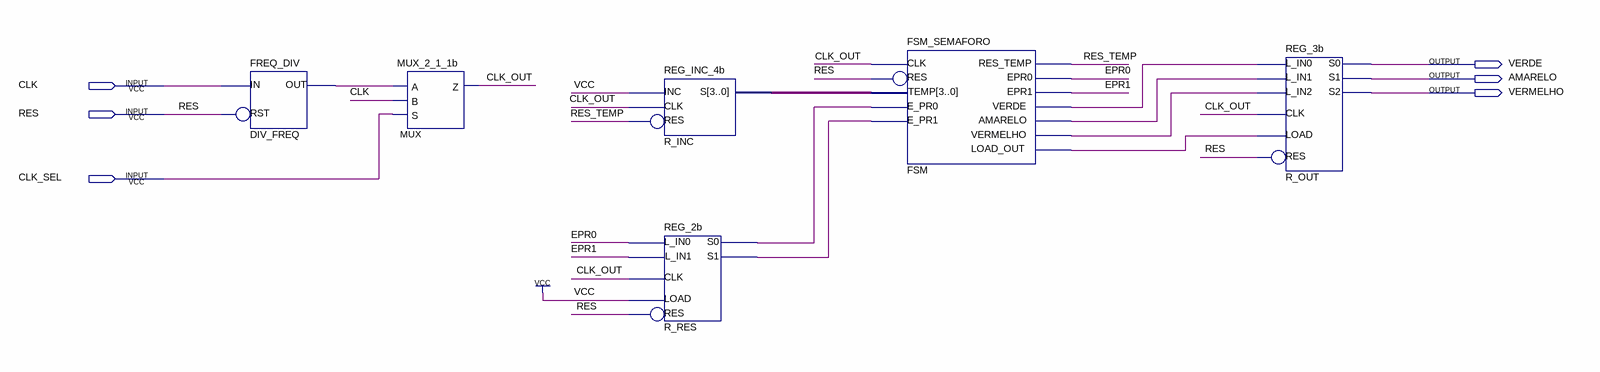
[diagram p0: schematic sheet]
// Quartus schematic SEMAFORO.bdf as structural Verilog: 6 symbols, 6 pins
module SEMAFORO (
  input  CLK,
  input  RES,
  input  CLK_SEL,
  output VERDE,
  output AMARELO,
  output VERMELHO
);

  wire CLK_OUT, DIV_FREQ_out, EPR0, EPR1, FSM_amarelo, FSM_load_out, FSM_verde, FSM_vermelho, R_RES_s0,
       R_RES_s1, RES_TEMP;
  wire [3:0] R_INC_s;

  FREQ_DIV DIV_FREQ (.IN(CLK), .RST(RES), .OUT(DIV_FREQ_out));
  MUX_2_1_1b MUX (.A(DIV_FREQ_out), .B(CLK), .S(CLK_SEL), .Z(CLK_OUT));
  REG_INC_4b R_INC (.INC(1'b1), .CLK(CLK_OUT), .RES(RES_TEMP), .S(R_INC_s));
  REG_2b R_RES (.L_IN0(EPR0), .L_IN1(EPR1), .LOAD(1'b1), .CLK(CLK_OUT), .RES(RES), .S0(R_RES_s0), .S1(R_RES_s1));
  FSM_SEMAFORO FSM (
    .CLK(CLK_OUT), .RES(RES), .TEMP(R_INC_s), .E_PR0(R_RES_s0), .E_PR1(R_RES_s1), .RES_TEMP(RES_TEMP),
    .EPR0(EPR0), .EPR1(EPR1), .VERDE(FSM_verde), .AMARELO(FSM_amarelo), .VERMELHO(FSM_vermelho),
    .LOAD_OUT(FSM_load_out));
  REG_3b R_OUT (
    .L_IN0(FSM_verde), .L_IN1(FSM_amarelo), .L_IN2(FSM_vermelho), .LOAD(FSM_load_out), .CLK(CLK_OUT),
    .RES(RES), .S0(VERDE), .S1(AMARELO), .S2(VERMELHO));
endmodule
